# Altium schematic sheet LCD-43.SchDoc: LCD 4.3" with Capacitive Touch
size A4; Date: 25-FEB-2015; Author: A.B; CompanyName: STMicroelectronics; Address1: 12, Rue Jules HOROWITZ; Address2: 38019 Grenoble; Address3: FRANCE; DocumentNumber: MB1191; Revision: B-02; SheetNumber: 14; SheetTotal: 14; Project: STM32F746G-DISCO
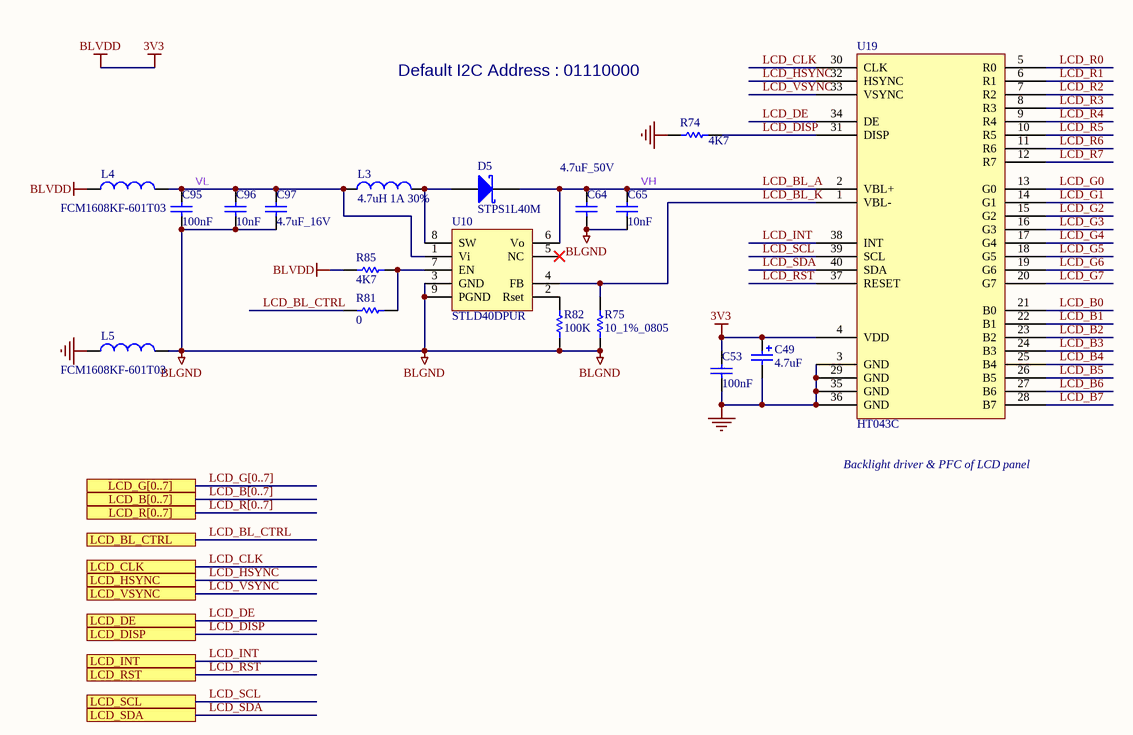
[diagram p0: LCD-43.SchDoc]

## Parts
C49  4.7uF  [TAN-A]
C53  100nF  [0402C]
C64  4.7uF_50V  [1206C]
C65  10nF  [0603C]
C95  100nF  [0603C]
C96  10nF  [0603C]
C97  4.7uF_16V  [1206C]
D5  STPS1L40M  [DO216-AA]
L3  4.7uH 1A 30%  [1210L]
L4  FCM1608KF-601T03  [0603L]
L5  FCM1608KF-601T03  [0603L]
R74  4K7  [0402R]
R75  10_1%_0805  [0805R]
R81  0  [0402R]
R82  100K  [0402R]
R85  4K7  [0402R]
U10  STLD40DPUR  [QFN8_0R65_3X3_ST]
U19  HT043C  [LCD_Kunjian_ HT043C_40P_P080_FLEX_FOLDED]

## Ports
LCD_B[0..7], LCD_BL_CTRL, LCD_CLK, LCD_DE, LCD_DISP, LCD_G[0..7], LCD_HSYNC, LCD_INT, LCD_R[0..7], LCD_RST, LCD_SCL, LCD_SDA, LCD_VSYNC

## Nets
3V3: C49.1 C53.2 L4.1 R85.2 U19.4(VDD)  [also labelled BLVDD]
BLGND: C64.2 C65.1 C95.1 C96.1 C97.2 L5.2 R75.1 R82.2 U10.3(GND) U10.9(PGND)
GND: C49.2 C53.1 L5.1 R74.2 U19.3(GND) U19.29(GND) U19.35(GND) U19.36(GND)
LCD_B0: U19.21(B0)
LCD_B1: U19.22(B1)
LCD_B2: U19.23(B2)
LCD_B3: U19.24(B3)
LCD_B4: U19.25(B4)
LCD_B5: U19.26(B5)
LCD_B6: U19.27(B6)
LCD_B7: U19.28(B7)
LCD_BL_A: C64.1 C65.2 D5.2(K) U10.6(Vo) U19.2(VBL+)  [also labelled VH]
LCD_BL_CTRL: R81.2 ; port LCD_BL_CTRL
LCD_BL_K: R75.2 U10.4(FB) U19.1(VBL-)
LCD_CLK: U19.30(CLK) ; port LCD_CLK
LCD_DE: U19.34(DE) ; port LCD_DE
LCD_DISP: R74.1 U19.31(DISP) ; port LCD_DISP
LCD_G0: U19.13(G0)
LCD_G1: U19.14(G1)
LCD_G2: U19.15(G2)
LCD_G3: U19.16(G3)
LCD_G4: U19.17(G4)
LCD_G5: U19.18(G5)
LCD_G6: U19.19(G6)
LCD_G7: U19.20(G7)
LCD_HSYNC: U19.32(HSYNC) ; port LCD_HSYNC
LCD_INT: U19.38(INT) ; port LCD_INT
LCD_R0: U19.5(R0)
LCD_R1: U19.6(R1)
LCD_R2: U19.7(R2)
LCD_R3: U19.8(R3)
LCD_R4: U19.9(R4)
LCD_R5: U19.10(R5)
LCD_R6: U19.11(R6)
LCD_R7: U19.12(R7)
LCD_RST: U19.37(RESET) ; port LCD_RST
LCD_SCL: U19.39(SCL) ; port LCD_SCL
LCD_SDA: U19.40(SDA) ; port LCD_SDA
LCD_VSYNC: U19.33(VSYNC) ; port LCD_VSYNC
VL: C95.2 C96.2 C97.1 L3.1 L4.2 U10.1(Vi)
NetD5_1: D5.1(A) L3.2 U10.8(SW)
NetR81_1: R81.1 R85.1 U10.7(EN)
NetR82_1: R82.1 U10.2(Rset)

Not connected (* = marked no-connect by the designer): U10 5(NC)*

## Buses and harness runs
bus LCD_B[0..7] = port LCD_B[0..7]
bus LCD_G[0..7] = port LCD_G[0..7]
bus LCD_R[0..7] = port LCD_R[0..7]

## Notes on the sheet
- Default I2C Address : 01110000
- Backlight driver & PFC of LCD panel
- Title:
- Project:
- Size:
- Revision:
- Variant:
- A4
- -
- Date:
- Reference:
- Sheet:
- of

## Library data of the parts
C49 = Cap_4.7uF_POL_10%_TANA: Polarized Capacitor,4.7uF,16V,10%,typeA,AVX; Manuf_Part_1: TAJA475K016R; Revision: July-2002: Re-released for DXP Platform.; Value: 4.7uF; Manuf_1: AVX; Order: TAJA475K016R; ECCN_US/EU: n/a
C53 = Cap_100nF_X7R_10%_0402: Capacitor,100nF,16V,X7R,10%,0402,YAGEO; Manuf_Part_1: CC0402KRX7R7BB104; Revision: July-2002: Re-released for DXP Platform.; Value: 100nF; Order: CC0402KRX7R7BB104; Manuf_1: YAGEO; ECCN_US/EU: n/a
C64 = Cap_4.7uF_X7R_10%_1206: Capacitor,4.7uF,50V, X7R,10%,1206,AVX; Manuf_Part_1: 12065C475KAT2A; Revision: July-2002: Re-released for DXP Platform.; Value: 4.7uF; Order: *; Manuf_1: AVX; ECCN_US/EU: n/a; Distrib: FARNELL
C65 C96 = Cap_10nF_X7R_10%_0603: Capacitor,10nF,50V,X7R,10%,0603,YAGEO; Manuf_Part_1: CC0603KRX7R9BB103; Revision: July-2002: Re-released for DXP Platform.; Value: 10nF; Order: CC0603KRX7R9BB103; Manuf_1: YAGEO; ECCN_US/EU: n/a
C95 = Cap_100nF_X7R_10%_0603: Capacitor,100nF,16V,X7R,10%,0603,YAGEO; Manuf_Part_1: CC0603KRX7R9BB104; Revision: July-2002: Re-released for DXP Platform.; Value: 100nF; Order: CC0603KRX7R9BB104; Manuf_1: YAGEO; ECCN_US/EU: n/a
C97 = Cap_4.7uF_X5R_10%_1206: Capacitor,4.7uF,16V, X5R,10%,1206,AVX; Manuf_Part_1: 1206YD475KAT2A; Revision: July-2002: Re-released for DXP Platform.; Value: 4.7uF; Order: *; Manuf_1: AVX; ECCN_US/EU: n/a; Distrib: FARNELL
D5 = STPS1L40M: Low Drop power Schottky rectifier(1A, 40V, 0.4V); Manuf_1: STM; Provided: ST; Ref St: 9151085; ECCN_US/EU: EAR99/NEC; Manuf_Part_1: STPS1L40M; Order: STPS1L40M; Distrib: ST; Code - JEDEC: *
L3 = Ind_4.7uH_1A_30%: FIXED IND 4.7UH 1A 180 MOHM 30% SMD; Manuf_Part_1: LQH32PN4R7NN0L; Manuf_1: MURATA; Order: 490-5338-1-ND; Distrib: DIGIKEY; ECCN_US/EU: n/a
L4 L5 = BEAD_600R_350MA_0603: Bead,600R,350mA,0603,FCM1608KF-601T03,Tai-tech; Manuf_2: TDK; Manuf_Part_2: MPZ1608S300A; Manuf_Part_3: BLM18PG121SN1D; Manuf_3: MURATA; Value: 100uH; Description_2: Bead,30R,5A,0603,MPZ1608S300A,TDK; Description_3: Bead,120R,2A,0603,BLM18PG121SN1D,MURATA; Revision: July-2002: Re-released for DXP Platform.; Manuf_Part_1: FCM1608KF-601T03; Manuf_1: Tai-tech; ECCN_US/EU: n/a
R74 R85 = Res_4K7_1%_0402: Resistor,4K7,0402,1%,YAGEO; Manuf_Part_1: RT0402FRE074K7L; Value: 4K7; Manuf_1: YAGEO; Order: RT0402FRE074K7L; ECCN_US/EU: n/a
R75 = Res_10_1%_0805: Resistor,10,0805,1%,Stackpole,1/4W; Manuf_Part_1: RNCP0805FTD10R0; Manuf_1: Stackpole Electronics Inc; Value: 10; Order: RNCP0805FTD10R0; ECCN_US/EU: n/a
R81 = Res_0_5%_0402: Resistor,0,0402,5%,YAGEO; Manuf_Part_1: RC0402JR-070RL; Order: 2363467; Value: 0; ECCN_US/EU: n/a; Manuf_1: YAGEO; Distrib: FARNELL
R82 = Res_100K_1%_0402: Resistor,100K,0402,1%,YAGEO; Manuf_Part_1: RT0402FRE07100KL; Value: 100K; Manuf_1: YAGEO; Order: RT0402FRE07100KL; ECCN_US/EU: n/a
U10 = STLD40DPUR: White LED power supply for large display backlight, QFN8; Manuf_1: STM; ECCN_US/EU: EAR99/NEC; Ref St: xxxxxxxxx; Provided: ST; Order: STLD40DPUR; Manuf_Part_1: STLD40DPUR; Distrib: ST
U19 = HT043C: 4.3 inch TFT 480*272 pixels with LED Backlight and Capacitive touch panel, high luminance; Manuf_1: KUNJIAN; ECCN_US/EU: EAR99/NEC; Manuf_Part_1: HT043C; Distrib: Sub Co; Ref St: *